# Altium schematic sheet DDRMemory .SchDoc
size A4; SheetNumber: 5; SheetTotal: 9
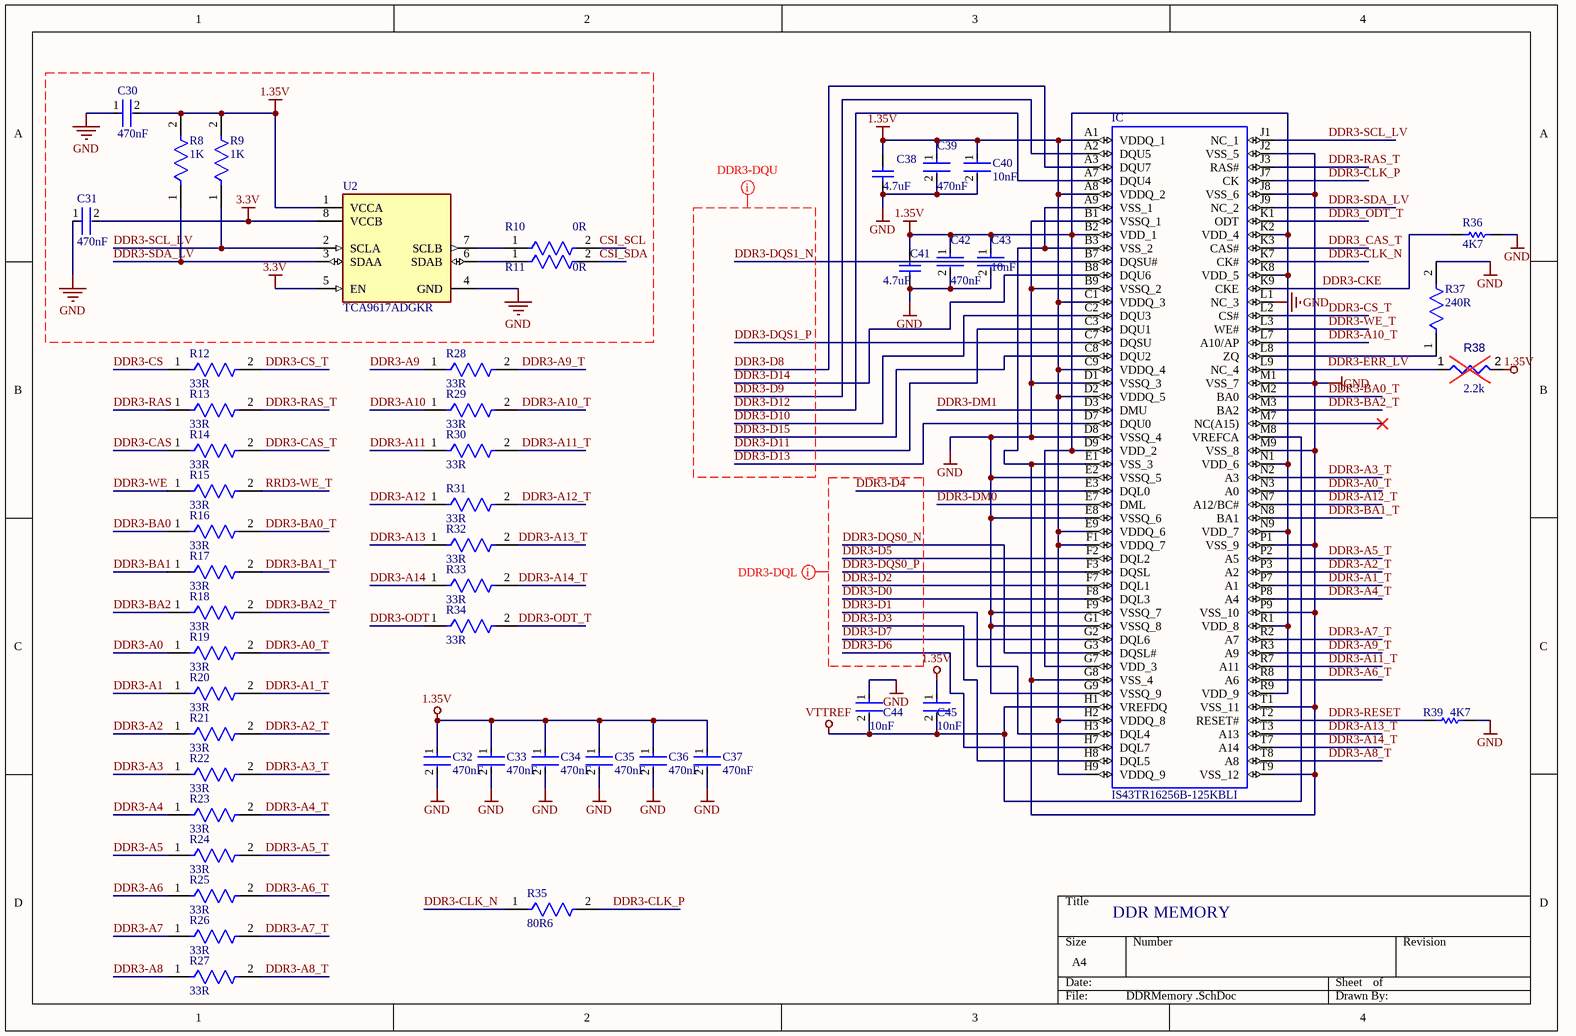
[diagram p0: DDRMemory .SchDoc]

## Parts
C30  470nF  [FP-CC0603-DA-MFG]
C31  470nF  [FP-CC0603-DA-MFG]
C32  470nF  [FP-0603-L_1_6_0_1-W_0_8_0-IPC_C]
C33  470nF  [FP-0603-L_1_6_0_1-W_0_8_0-IPC_C]
C34  470nF  [FP-0603-L_1_6_0_1-W_0_8_0-IPC_C]
C35  470nF  [FP-0603-L_1_6_0_1-W_0_8_0-IPC_C]
C36  470nF  [FP-0603-L_1_6_0_1-W_0_8_0-IPC_C]
C37  470nF  [FP-0603-L_1_6_0_1-W_0_8_0-IPC_C]
C38  4.7uF  [CAPC1005X71X25NL10T15]
C39  470nF  [FP-0402-L_1_0_1-W_0_5_0_1-IPC_C]
C40  10nF  [FP-CC0402-MFG]
C41  4.7uF  [CAPC1005X71X25NL10T15]
C42  470nF  [FP-0402-L_1_0_1-W_0_5_0_1-IPC_C]
C43  10nF  [FP-CC0402-MFG]
C44  10nF  [FP-CC0402-MFG]
C45  10nF  [FP-CC0402-MFG]
IC  IS43TR16256B-125KBLI  [BGA96C80P9X16_900X1300X120]
R8  1K  [FP-AC0603-IPC_B]
R9  1K  [FP-AC0603-IPC_B]
R10  0R  [FP-AC0603-IPC_A]
R11  0R  [FP-AC0603-IPC_A]
R12  33R  [FP-AF0201-IPC_A]
R13  33R  [FP-AF0201-IPC_A]
R14  33R  [FP-AF0201-IPC_A]
R15  33R  [FP-AF0201-IPC_A]
R16  33R  [FP-AF0201-IPC_A]
R17  33R  [FP-AF0201-IPC_A]
R18  33R  [FP-AF0201-IPC_A]
R19  33R  [FP-AF0201-IPC_A]
R20  33R  [FP-AF0201-IPC_A]
R21  33R  [FP-AF0201-IPC_A]
R22  33R  [FP-AF0201-IPC_A]
R23  33R  [FP-AF0201-IPC_A]
R24  33R  [FP-AF0201-IPC_A]
R25  33R  [FP-AF0201-IPC_A]
R26  33R  [FP-AF0201-IPC_A]
R27  33R  [FP-AF0201-IPC_A]
R28  33R  [FP-AF0201-IPC_A]
R29  33R  [FP-AF0201-IPC_A]
R30  33R  [FP-AF0201-IPC_A]
R31  33R  [FP-AF0201-IPC_A]
R32  33R  [FP-AF0201-IPC_A]
R33  33R  [FP-AF0201-IPC_A]
R34  33R  [FP-AF0201-IPC_A]
R35  80R6  [FP-RQ732B-IPC_C]
R36  4K7  [RESC1812(4532)_N]
R37  240R  [FP-RNCP0402-IPC_C]
R38  value 2.2k  [RESC0402(1005)_L]  (hidden comment: 2D2KR2J)
R39  4K7  [RESC1812(4532)_N]
U2  TCA9617ADGKR  [FP-DGK0008A-MFG]

## Nets
1.35V: C30.1 C30.2 C31.1 C32.1 C32.2 C33.1 C33.2 C34.1 C34.2 C35.1 C35.2 C36.1 C36.2 C37.1 C37.2 C38.1 C38.2 C39.1 C39.2 C40.1 C40.2 C41.1 C41.2 C42.1 C42.2 C43.1 C43.2 C44.1 C45.1 IC.A1(VDDQ_1) IC.A8(VDDQ_2) IC.A9(VSS_1) IC.B1(VSSQ_1) IC.B2(VDD_1) IC.B3(VSS_2) IC.B9(VSSQ_2) IC.C1(VDDQ_3) IC.C9(VDDQ_4) IC.D1(VSSQ_3) IC.D2(VDDQ_5) IC.D8(VSSQ_4) IC.D9(VDD_2) IC.E1(VSS_3) IC.E2(VSSQ_5) IC.E8(VSSQ_6) IC.E9(VDDQ_6) IC.F1(VDDQ_7) IC.F9(VSSQ_7) IC.G1(VSSQ_8) IC.G7(VDD_3) IC.G8(VSS_4) IC.G9(VSSQ_9) IC.H2(VDDQ_8) IC.H9(VDDQ_9) IC.J2(VSS_5) IC.J8(VSS_6) IC.K2(VDD_4) IC.K8(VDD_5) IC.L1(NC_3) IC.M1(VSS_7) IC.M9(VSS_8) IC.N1(VDD_6) IC.N9(VDD_7) IC.P1(VSS_9) IC.P9(VSS_10) IC.R1(VDD_8) IC.R9(VDD_9) IC.T1(VSS_11) IC.T9(VSS_12) R8.2 R9.2 R36.2 R37.2 R38.2 R39.2 U2.1(VCCA) U2.4(GND)  [also labelled GND]
3.3V: C31.2 U2.5(EN) U2.8(VCCB)
VTTREF: C44.2 C45.2 IC.H1(VREFDQ) IC.M8(VREFCA)
CSI_SCL: R10.2
CSI_SDA: R11.2
DDR3-A0: R19.1
DDR3-A0_T: IC.N3(A0) R19.2
DDR3-A1: R20.1
DDR3-A1_T: IC.P7(A1) R20.2
DDR3-A2: R21.1
DDR3-A2_T: IC.P3(A2) R21.2
DDR3-A3: R22.1
DDR3-A3_T: IC.N2(A3) R22.2
DDR3-A4: R23.1
DDR3-A4_T: IC.P8(A4) R23.2
DDR3-A5: R24.1
DDR3-A5_T: IC.P2(A5) R24.2
DDR3-A6: R25.1
DDR3-A6_T: IC.R8(A6) R25.2
DDR3-A7: R26.1
DDR3-A7_T: IC.R2(A7) R26.2
DDR3-A8: R27.1
DDR3-A8_T: IC.T8(A8) R27.2
DDR3-A9: R28.1
DDR3-A9_T: IC.R3(A9) R28.2
DDR3-A10: R29.1
DDR3-A10_T: IC.L7(A10/AP) R29.2
DDR3-A11: R30.1
DDR3-A11_T: IC.R7(A11) R30.2
DDR3-A12: R31.1
DDR3-A12_T: IC.N7(A12/BC#) R31.2
DDR3-A13: R32.1
DDR3-A13_T: IC.T3(A13) R32.2
DDR3-A14: R33.1
DDR3-A14_T: IC.T7(A14) R33.2
DDR3-BA0: R16.1
DDR3-BA0_T: IC.M2(BA0) R16.2
DDR3-BA1: R17.1
DDR3-BA1_T: IC.N8(BA1) R17.2
DDR3-BA2: R18.1
DDR3-BA2_T: IC.M3(BA2) R18.2
DDR3-CAS: R14.1
DDR3-CAS_T: R14.2
DDR3-CKE: IC.K9(CKE) R36.1
DDR3-CLK_N: IC.K7(CK#) R35.1
DDR3-CLK_P: IC.J7(CK) R35.2
DDR3-CS: R12.1
DDR3-CS_T: IC.L2(CS#) R12.2
DDR3-D0: IC.F8(DQL3)
DDR3-D1: IC.H3(DQL4)
DDR3-D2: IC.F7(DQL1)
DDR3-D3: IC.H8(DQL5)
DDR3-D4: IC.E3(DQL0)
DDR3-D5: IC.F2(DQL2)
DDR3-D6: IC.H7(DQL7)
DDR3-D7: IC.G2(DQL6)
DDR3-D8: IC.A3(DQU7)
DDR3-D9: IC.A2(DQU5)
DDR3-D10: IC.C2(DQU3)
DDR3-D11: IC.C3(DQU1)
DDR3-D12: IC.A7(DQU4)
DDR3-D13: IC.D7(DQU0)
DDR3-D14: IC.B8(DQU6)
DDR3-D15: IC.C8(DQU2)
DDR3-DM0: IC.E7(DML)
DDR3-DM1: IC.D3(DMU)
DDR3-DQS0_N: IC.G3(DQSL#)
DDR3-DQS0_P: IC.F3(DQSL)
DDR3-DQS1_N: IC.B7(DQSU#)
DDR3-DQS1_P: IC.C7(DQSU)
DDR3-ERR_LV: IC.L9(NC_4) R38.1
DDR3-ODT: R34.1
DDR3-ODT_T: R34.2
DDR3-RAS: R13.1
DDR3-RAS_T: IC.J3(RAS#) R13.2
DDR3-RESET: IC.T2(RESET#) R39.1
DDR3-SCL_LV: IC.J1(NC_1) R9.1 U2.2(SCLA)
DDR3-SDA_LV: IC.J9(NC_2) R8.1 U2.3(SDAA)
DDR3-WE: R15.1
DDR3-WE_T: IC.L3(WE#)
DDR3_CAS_T: IC.K3(CAS#)
DDR3_ODT_T: IC.K1(ODT)
RRD3-WE_T: R15.2
NetIC_L8: IC.L8(ZQ) R37.1
NetR10_1: R10.1 U2.7(SCLB)
NetR11_1: R11.1 U2.6(SDAB)

Not connected (* = marked no-connect by the designer): IC M7(NC(A15))*

## Layout directives
mark named DDR3-DQU: DDR3-D8, DDR3-D9, DDR3-D10, DDR3-D11, DDR3-D12, DDR3-D13, DDR3-D14, DDR3-D15, DDR3-DQS1_N, DDR3-DQS1_P
mark named DDR3-DQL: DDR3-D0, DDR3-D1, DDR3-D2, DDR3-D3, DDR3-D4, DDR3-D5, DDR3-D6, DDR3-D7, DDR3-DQS0_N, DDR3-DQS0_P

## Notes on the sheet
- DDR MEMORY

## Library data of the parts
C30 C31 = CMP-03422-000186-1: CAP CER 0.47UF 6.3V X5R 0603; Manufacturer Part Number: CC0603KRX5R5BB474; Manufacturer: YAGEO; Temperature Coefficient: 15%; Tolerance: 0.1; Material: Ceramic; Device Class L3: Ceramic Capacitors; Temperature Range Low: -55°C; ComponentLink2Description: Datasheet; Lead Free: Yes; Height: 0.9mm; Category: Cap; Value: 470 nF; Voltage: 6.3 V; Mouser Description: Multilayer Ceramic Capacitors MLCC - SMD/SMT 470nF 6.3V X5R 10%; Capacitance: 470 nF; Octopart: https://octopart.com/cc0603krx5r5bb474-yageo-9288194; Temperature Characteristic: X5R; Digikey Description: CAP CER 0.47UF 6.3V X5R 0603; Automotive: No; Voltage Rating: 6.3 V; RoHS: TRUE; Device Class L1: Passive Components; Footprint Url: http://www.yageo.com/exep/pages/download/literatures/UPY-C_GEN_24.pdf; Temperature Range High: +125°C; Temperature: -55°C to +125°C; Device Class L2: Capacitors; Package: CC0603-DA; ComponentLink2URL: http://www.yageo.com/documents/recent/UPY-GPHC_X7R_6.3V-to-50V_18.pdf
C32-C37 = CMP-14477-002910-2: None; Voltage Rating (DC): 16V; Tolerance: 20%; Dielectric: X7R; Dielectric Material: Ceramic; Length: 1.6mm; Series: M; Package Quantity: 4000; Case/Package: 0603; Thickness: 0.035inch; Depth: 0.8mm; Halogen Free: Halogen Free; Voltage Rating: 16V; Termination: SMD/SMT; Number of Pins: 2; Construction: Flat; RoHS Compliant: Yes; Weight: 7.1E-05oz; Height: 0.8mm; Capacitance: 470nF; Packaging: Tape and Reel; Max Operating Temperature: 125°C; Mount: Surface Mount; Radiation Hardening: No; Width: 0.031inch; Min Operating Temperature: -55°C; Case Code (Imperial): 0603; Case Code (Metric): 1608; Resistor Type: Ceramic
C38 C41 = CMP-2008-02043-1: Part Number: 0402ZD475MAT2A; Manufacturer: AVX Interconnect / Elco
C39 C42 = CMP-04427-019216-1: General Purpose Ceramic Capacitor, 0402, 470nF, 10%, X7R, 15%, 10V; RoHS Compliant: Yes
C40 C43-C45 = CMP-03422-000189-1: CAP CER 10000PF 10V X7R 0402; Manufacturer Part Number: CC0402MRX7R6BB103; Manufacturer: YAGEO; Material: Ceramic; Automotive Grade: NA; Temperature Coefficient: 30ppm/°C; Tolerance: 0.2; Digikey Description: CAP CER 10000PF 10V X7R 0402; Package: CC0402; Height: 0.55mm; RoHS: TRUE; Temperature Characteristic: X7R; Ipc Land Pattern Name: CAPC10050X50; Device Class L3: Ceramic Capacitors; Value: 10 nF; Lead Free: Yes; ComponentLink2URL: http://www.yageo.com/documents/recent/UPY-GP_NP0_16V-to-50V_16.pdf; Device Class L2: Capacitors; Voltage Rating: 10 V; ComponentLink2Description: Datasheet; Mouser Description: Multilayer Ceramic Capacitors MLCC - SMD/SMT 10nF 10V X7R 20%; Automotive: No; Temperature Range Low: -55°C; Device Class L1: Passive Components; Category: Cap; Capacitance: 10 nF; Octopart: https://octopart.com/cc0402mrx7r6bb103-yageo-71334382; Temperature: -55°C to +125°C; Temperature Range High: +125°C; Footprint Url: http://www.yageo.com/exep/pages/download/literatures/UPY-C_GEN_24.pdf
IC = IS43TR16256B-125KBLI: SDRAM - DDR3 Memory IC 4Gb (256M x 16) Parallel 800MHz 20ns 96-TWBGA (9x13); MF: ISSI, Integrated Silicon Solution Inc; Availability: Unavailable; Mouser-Purchase-URL: https://snapeda.com/shop?store=Mouser&id=3661934; Price: None; DigiKey-Purchase-URL: https://snapeda.com/shop?store=DigiKey&id=3661934; Package: TFBGA-96 ISSI, Integrated Silicon Solution Inc; Value: *; SnapEDA_Link: https://www.snapeda.com/parts/IS43TR16256B-125KBLI/ISSI,%20Integrated%20Silicon%20Solution%20Inc/view-part/3661934/?ref=snap; MP: IS43TR16256B-125KBLI
R8 R9 = CMP-03412-047577-1: RES 1kΩ 1.00% 0.2W 0603
R10 R11 = CMP-03412-047235-1: RES 0Ω 0.00% 0.1W 0603; Tolerance: 5%; Resistance: 0mR; Case/Package: 0603; RoHS Compliant: Yes; Lead Free: Lead Free
R12-R34 = CMP-03412-042108-1: Anti-Sulfurated Chip Resistors Automotive Grade 33Ω 5% 200ppm/°C 0201; Max Power Dissipation: 50mW; Number of Terminations: 2; Resistance: 33R; Series: AF; RoHS Compliant: Yes; Temperature Coefficient: 200ppm/°C; Length: 0.024inch; Max Operating Temperature: 125°C; Tolerance: 5%; Height: 0.01inch; Case/Package: 0201; Packaging: Tape and Reel; Min Operating Temperature: -55°C; Features: Moisture Resistant; Width: 0.012inch; Resistor Type: Thick Film
R35 = CMP-03211-009713-1: RQ732B 1206 80.6Ω 0.4W 10ppm/°C 0.1% 200V; Manufacturer Part Number: RQ73C2B80R6BTDF; Manufacturer: TE; Automotive Grade: Grade 0; Temperature: -55°C to +155°C; Device Class L1: Passive Components; Temperature Coefficient: 10ppm/°C; Temperature Range High: +155°C; ComponentLink2URL: https://www.te.com/commerce/DocumentDelivery/DDEController?Action=showdoc&DocId=Data+Sheet%7F1773270-2%7FA%7Fpdf%7FEnglish%7FENG_DS_1773270-2_A.pdf%7F9-2176388-1024; Resistance: 80.6Ω; Height: 0.75mm; Device Class L2: Resistors; RoHS: TRUE; Automotive: Yes; ComponentLink2Description: Datasheet; Voltage Rating: 200V; Composition: Thin Film; Lead Free: Yes; Tolerance: 0.1%; Value: 80.6Ω; Ipc Land Pattern Name: RESC310160X60; Device Class L3: Chip SMD Resistors; Power Rating: 0.4W; Octopart: https://octopart.com/rq73c2b80r6btdf-te+connectivity-99292777; Package: RQ732B; Temperature Range Low: -55°C; Category: Res; Series: RQ73
R36 R39 = CMP-1016-00090-1: 4K7 0.75W 5% 1812 (4532 Metric)  SMD; Case-Metric: 4532; Case-EIA: 1812; Value: 4700.00 Ohm; Tolerance: 5 %; Power: 0.75 W; Technology: SMT
R37 = CMP-26527-003352-1: 240Ω ±1% 0.1W 0402 High Power Anti-Sulfur Thin Film Chip Resistor; Temperature Coefficient: 100ppm/°C; Mount: Surface Mount; Contact Plating: Tin; Tolerance: 1%; Max Operating Temperature: 155°C; Resistance: 240R; RoHS Compliant: Yes; Packaging: Tape and Reel; Min Operating Temperature: -55°C; Resistor Type: Thin Film; Radiation Hardening: No; Case/Package: 0402
R38 = CMP-009-00087-2: 2K2 0.063W 5% 0402 (1005 Metric)  SMD; Power: 63mW; Mounting Technology: SMT; Tolerance: 5%; Case/Package: 0402; Pins: 2
U2 = CMP-04881-000003-1: IC TRNSLTR BIDIRECTIONAL 8VSSOP; Manufacturer: Texas Instruments; Standoff Height: 0.05mm; Sigbufrep Type: Buffer; Interface: I2C; Delay Time: 94ns; Data Rate: 1Mbits/s; Max Supply Voltage: 5.5V; Min Supply Voltage: 0.8V; Input Capacitance: 9-14pF; Signal Conditioning: NA; Automotive: No; Ipc Land Pattern Name: SOP65P300X110-8; Temperature: -40°C to +85°C; ComponentLink2URL: http://www.ti.com/lit/ds/symlink/tca9617a.pdf; Temperature Range High: +85°C; Digikey Description: IC TRNSLTR BIDIRECTIONAL 8VSSOP; RoHS: TRUE; Height: 1.1mm; Device Class L2: Interface ICs; Lead Free: Yes; Ambient Temperature Range High: +85°C; Ambient Temperature Range Low: -40°C; Manufacturer Part Number: TCA9617ADGKR; Category: IC; Device Class L3: Repeaters; Mouser Description: IC V-LEVEL XLATR FM+ I2C 8VSSOP; Package: DGK0008A; ComponentLink2Description: Datasheet; Device Class L1: Integrated Circuits (ICs); Temperature Range Low: -40°C; Octopart: https://octopart.com/tca9617adgkr-texas+instruments-29775809